# Altium project learn_Project.PrjPcb
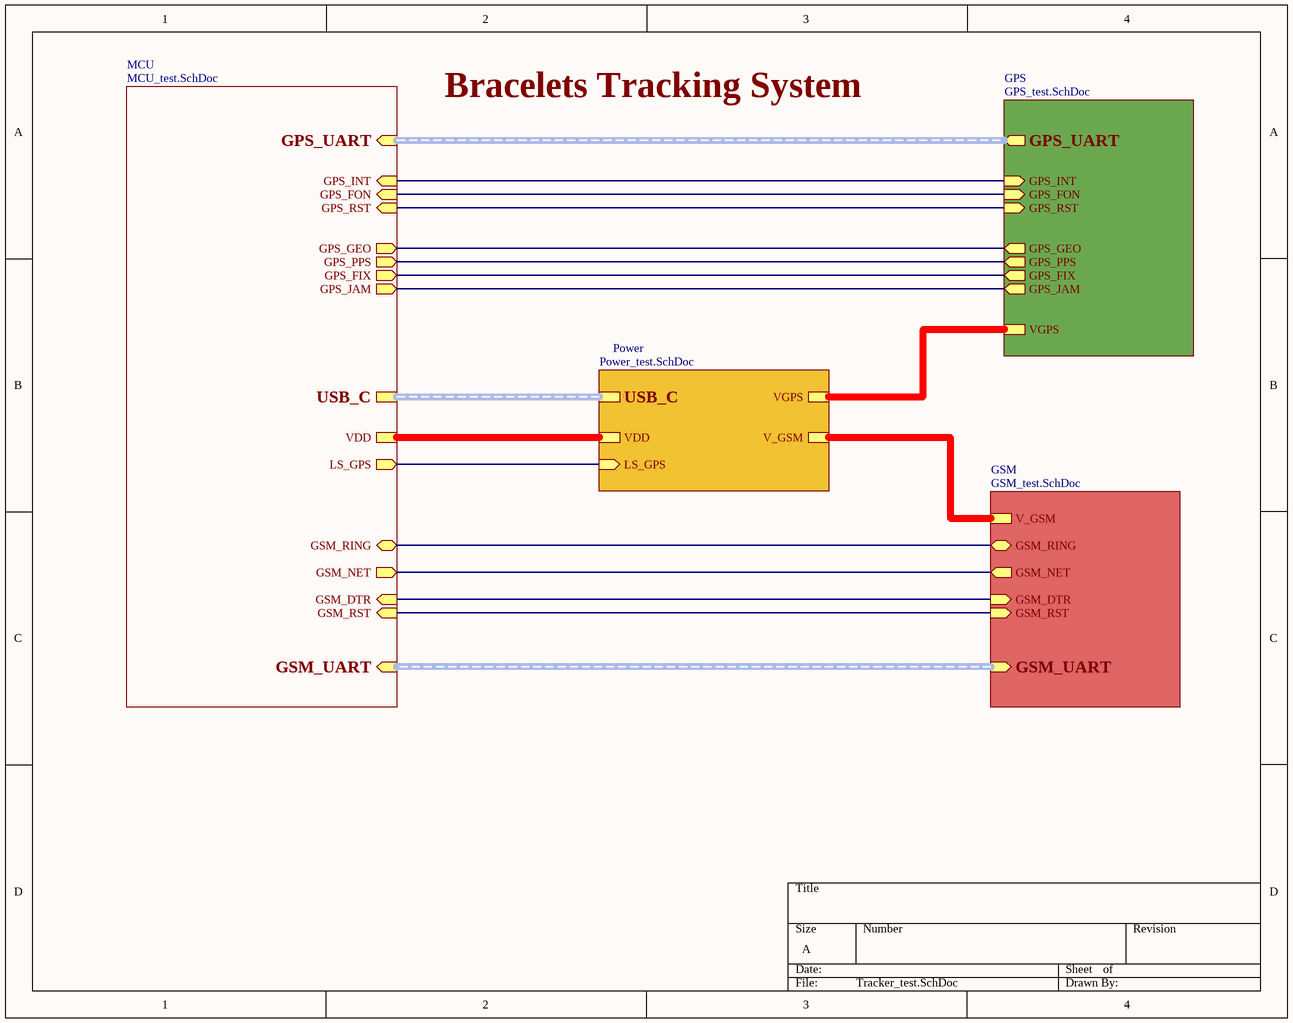
[diagram p0: Tracker_test.SchDoc]
5 sheets, 87 parts. Net scope: hierarchical (ports join the sheet entries above them; power ports are global).
Board file: Tracker.PcbDoc
Sheets:
  Tracker_test.SchDoc
    GPS = GPS_test.SchDoc
    Power = Power_test.SchDoc
    MCU = MCU_test.SchDoc
    GSM = GSM_test.SchDoc

## Sheet Tracker_test.SchDoc
size A; SheetNumber: 1; SheetTotal: 5

### Sub-sheets
GPS = GPS_test.SchDoc: VGPS, GPS_INT (in), GPS_RST (in), GPS_FON (in), GPS_PPS (out), GPS_JAM (out), GPS_FIX (out), GPS_GEO (out), GPS_UART (out, harness GPS_UART)
GSM = GSM_test.SchDoc: GSM_RING (bidir), GSM_DTR (in), GSM_NET (out), GSM_RST (in), GSM_UART (in, harness GSM_UART), V_GSM
MCU = MCU_test.SchDoc: GPS_UART (in, harness GPS_UART), GPS_INT (in), GPS_RST (in), GPS_FON (in), GPS_PPS (out), GPS_JAM (out), GPS_FIX (out), GPS_GEO (out), VDD, LS_GPS (out), GSM_RING (bidir), GSM_DTR (in), GSM_NET (out), GSM_RST (in), GSM_UART (in, harness GSM_UART), USB_C
Power = Power_test.SchDoc: VDD, VGPS, V_GSM, LS_GPS (in), USB_C

### Nets
DTR: sheet MCU/GSM_DTR, sheet GSM/GSM_DTR
GPS_FIX: sheet GPS/GPS_FIX, sheet MCU/GPS_FIX
GPS_FON: sheet GPS/GPS_FON, sheet MCU/GPS_FON
GPS_GEO: sheet GPS/GPS_GEO, sheet MCU/GPS_GEO
GPS_INT: sheet GPS/GPS_INT, sheet MCU/GPS_INT
GPS_JAM: sheet GPS/GPS_JAM, sheet MCU/GPS_JAM
GPS_PPS: sheet GPS/GPS_PPS, sheet MCU/GPS_PPS
GPS_RST: sheet GPS/GPS_RST, sheet MCU/GPS_RST
GSM_NET: sheet MCU/GSM_NET, sheet GSM/GSM_NET
GSM_RING: sheet MCU/GSM_RING, sheet GSM/GSM_RING
GSM_RST: sheet MCU/GSM_RST, sheet GSM/GSM_RST
LS_GPS: sheet Power/LS_GPS, sheet MCU/LS_GPS
(unnamed): sheet GPS/VGPS, sheet Power/VGPS
(unnamed): sheet Power/VDD, sheet MCU/VDD
(unnamed): sheet Power/V_GSM, sheet GSM/V_GSM

### Buses and harness runs
harness sheet GPS/GPS_UART = sheet MCU/GPS_UART
harness sheet GSM/GSM_UART = sheet MCU/GSM_UART
harness sheet MCU/USB_C = sheet Power/USB_C

### Notes on the sheet
- Bracelets Tracking System

## Sheet GPS_test.SchDoc
size A; SheetNumber: 3; SheetTotal: 5
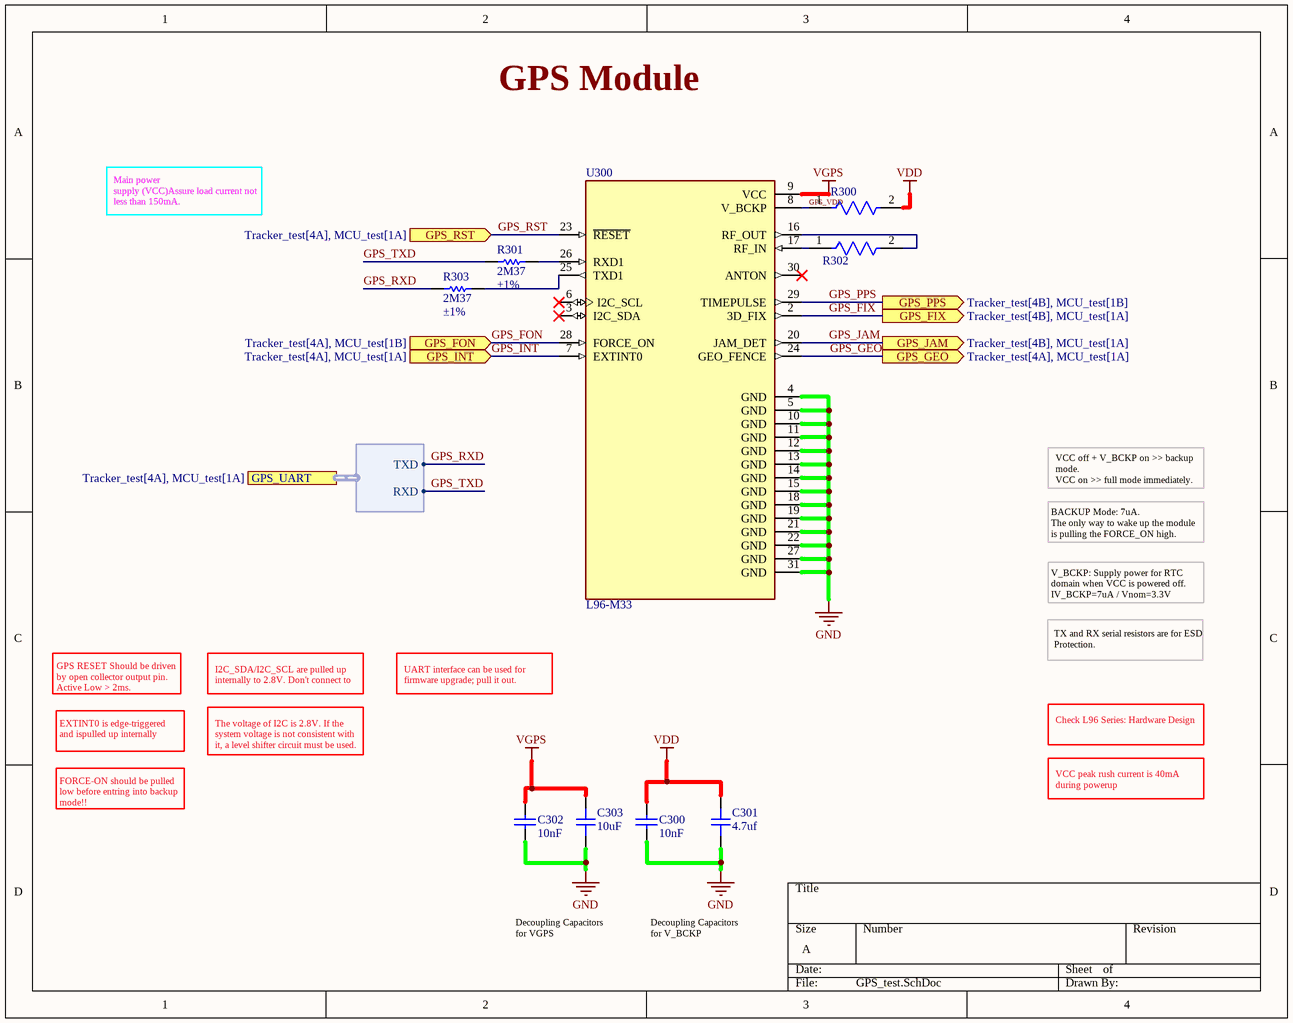
[diagram p1: GPS_test.SchDoc]

### Parts
C300  value 10nF  [C0402 - duplicate]  (hidden comment: CAP)
C301  4.7uf  [CAP_0402]
C302  value 10nF  [C0402 - duplicate]  (hidden comment: CAP)
C303  10uF  [CAP_0402]
R300  AF0402JR-070RL  [FP-AF0402-IPC_A]  (value not drawn)
R301  value 2M37  Tolerance: ±1%  [R0402]  (hidden comment: 100)
R302  AF0402JR-070RL  [FP-AF0402-IPC_A]  (value not drawn)
R303  value 2M37  Tolerance: ±1%  [R0402]  (hidden comment: 100)
U300  L96-M33  [XCVR_L96-M33]

### Ports
GPS_FIX (out, see Tracker_test[4B], MCU_test[1A]), GPS_FON (in, see Tracker_test[4A], MCU_test[1B]), GPS_GEO (out, see Tracker_test[4A], MCU_test[1A]), GPS_INT (in, see Tracker_test[4A], MCU_test[1A]), GPS_JAM (out, see Tracker_test[4B], MCU_test[1A]), GPS_PPS (out, see Tracker_test[4B], MCU_test[1B]), GPS_RST (in, see Tracker_test[4A], MCU_test[1A]), GPS_UART (harness GPS_UART, see Tracker_test[4A], MCU_test[1A])

### Harnesses
GPS_UART: TXD, RXD

### Nets
GND: C300.2 C301.1 C302.2 C303.1 U300.4(GND) U300.5(GND) U300.10(GND) U300.11(GND) U300.12(GND) U300.13(GND) U300.14(GND) U300.15(GND) U300.18(GND) U300.19(GND) U300.21(GND) U300.22(GND) U300.27(GND) U300.31(GND)
VDD: C300.1 C301.2 R300.2
VGPS: C302.1 C303.2 U300.9(VCC)
GPS_FIX: U300.2(3D_FIX) ; port GPS_FIX
GPS_FON: U300.28(FORCE_ON) ; port GPS_FON
GPS_GEO: U300.24(GEO_FENCE) ; port GPS_GEO
GPS_INT: U300.7(EXTINT0) ; port GPS_INT
GPS_JAM: U300.20(JAM_DET) ; port GPS_JAM
GPS_PPS: U300.29(TIMEPULSE) ; port GPS_PPS
GPS_RST: U300.23(~{RESET}) ; port GPS_RST
GPS_RXD: R303.1 ; port GPS_UART.TXD
GPS_TXD: R301.1 ; port GPS_UART.RXD
GPS_VDD: R300.1 U300.8(V_BCKP)
NetR301_2: R301.2 U300.26(RXD1)
NetR302_1: R302.1 U300.17(RF_IN)
NetR302_2: R302.2 U300.16(RF_OUT)
NetR303_2: R303.2 U300.25(TXD1)

Not connected (* = marked no-connect by the designer): U300 3(I2C_SDA)* 6(I2C_SCL)* 30(ANTON)*

### Notes on the sheet
- GPS Module
- Main power
  supply (VCC)Assure load current not
  less than 150mA.
- VCC off + V_BCKP on >> backup mode.
  VCC on >> full mode immediately.
- BACKUP Mode: 7uA.
  The only way to wake up the module is pulling the FORCE_ON high.
- V_BCKP: Supply power for RTC
  domain when VCC is powered off.
  IV_BCKP=7uA / Vnom=3.3V
- GPS RESET Should be driven by open collector output pin.
  Active Low > 2ms.
- I2C_SDA/I2C_SCL are pulled up internally to 2.8V. Don't connect to
- UART interface can be used for firmware upgrade; pull it out.
- TX and RX serial resistors are for ESD Protection.
- EXTINT0 is edge-triggered and ispulled up internally
- The voltage of I2C is 2.8V. If the system voltage is not consistent with it, a level shifter circuit must be used.
- Check L96 Series: Hardware Design
- FORCE-ON should be pulled low before entring into backup mode!!
- VCC peak rush current is 40mA during powerup
- Decoupling Capacitors for VGPS
- Decoupling Capacitors for V_BCKP

### Library data of the parts
C300 C302 = CAP: CAP CER 0.1UF 10V X7R 0603; Part Number: C00062; Manufacturer: KEMET - Electronic Component; Manufacturer Part Number: C0603C104K8RACTU; Tolerance: ±10%; Supplier 1: Digi-Key; Supplier Part Number 1: 399-1095-2-ND; HelpURL: http://www.kemet.com/Lists/ProductCatalog/Attachments/53/KEM_C1002_X7R_SMD.pdf; Operating Temperature: -55°C ~ 125°C; Type: CER; Temperature Coefficient: X7R; Voltage: 10V
C301 C303 = CAP_0402: Capacitor SMD 0402; Manufacturer: *; Manufacturer Part Number: *; Distributor Link: *; LCSC: *; Rating: *; Dielectric: *
R300 R302 = CMP-03412-048355-1: Anti-Sulfurated Chip Resistors Automotive Grade 0Ω 0402; Tolerance: 5%; Resistance: 0R; Max Power Dissipation: 63mW; Case Code (Metric): 1005; Packaging: Tape and Reel; Features: Moisture Resistant; Termination: SMD/SMT; Package Quantity: 10000; RoHS Compliant: Yes; Case/Package: 0402; Number of Terminations: 2; Series: AF; Length: 0.039inch; Max Operating Temperature: 155°C; Min Operating Temperature: -55°C; Resistor Type: Thick Film; Height: 0.015inch; Weight: 2.3E-05oz; Width: 0.5mm; Case Code (Imperial): 0402
R301 R303 = RES: RES SMD 15 OHM 1% 1/10W 0603; Part Number: R00007; Manufacturer: Yageo; Manufacturer Part Number: RC0603FR-0715RL; Temperature Coefficient: ±100ppm/°C; Supplier 1: Digi-Key; Supplier Part Number 1: 311-15.0HRCT-ND; HelpURL: http://www.yageo.com/NewPortal/yageodocoutput?fileName=/pdf/R-Chip/PYu-RC_Group_51_RoHS_L_3.pdf; Power: 1/10W; Operating Temperature: -55°C ~ 155°C
U300 = L96-M33: L96 is a concurrent multi-GNSS receiver module with embedded chip antenna. With 33 tracking channels, 99 acquisition channels and 210 PRN channels, L96 supports concurrent reception of up to three GNSS systems (GPS+GLONASS+Galileo); MF: Quectel; SnapEDA_Link: https://www.snapeda.com/parts/L96-M33/Quectel/view-part/2780781/?ref=snap; Price: None; MP: L96-M33; Availability: Unavailable; Value: *; Package: None

## Sheet Power_test.SchDoc
size A3; SheetNumber: 2; SheetTotal: 5
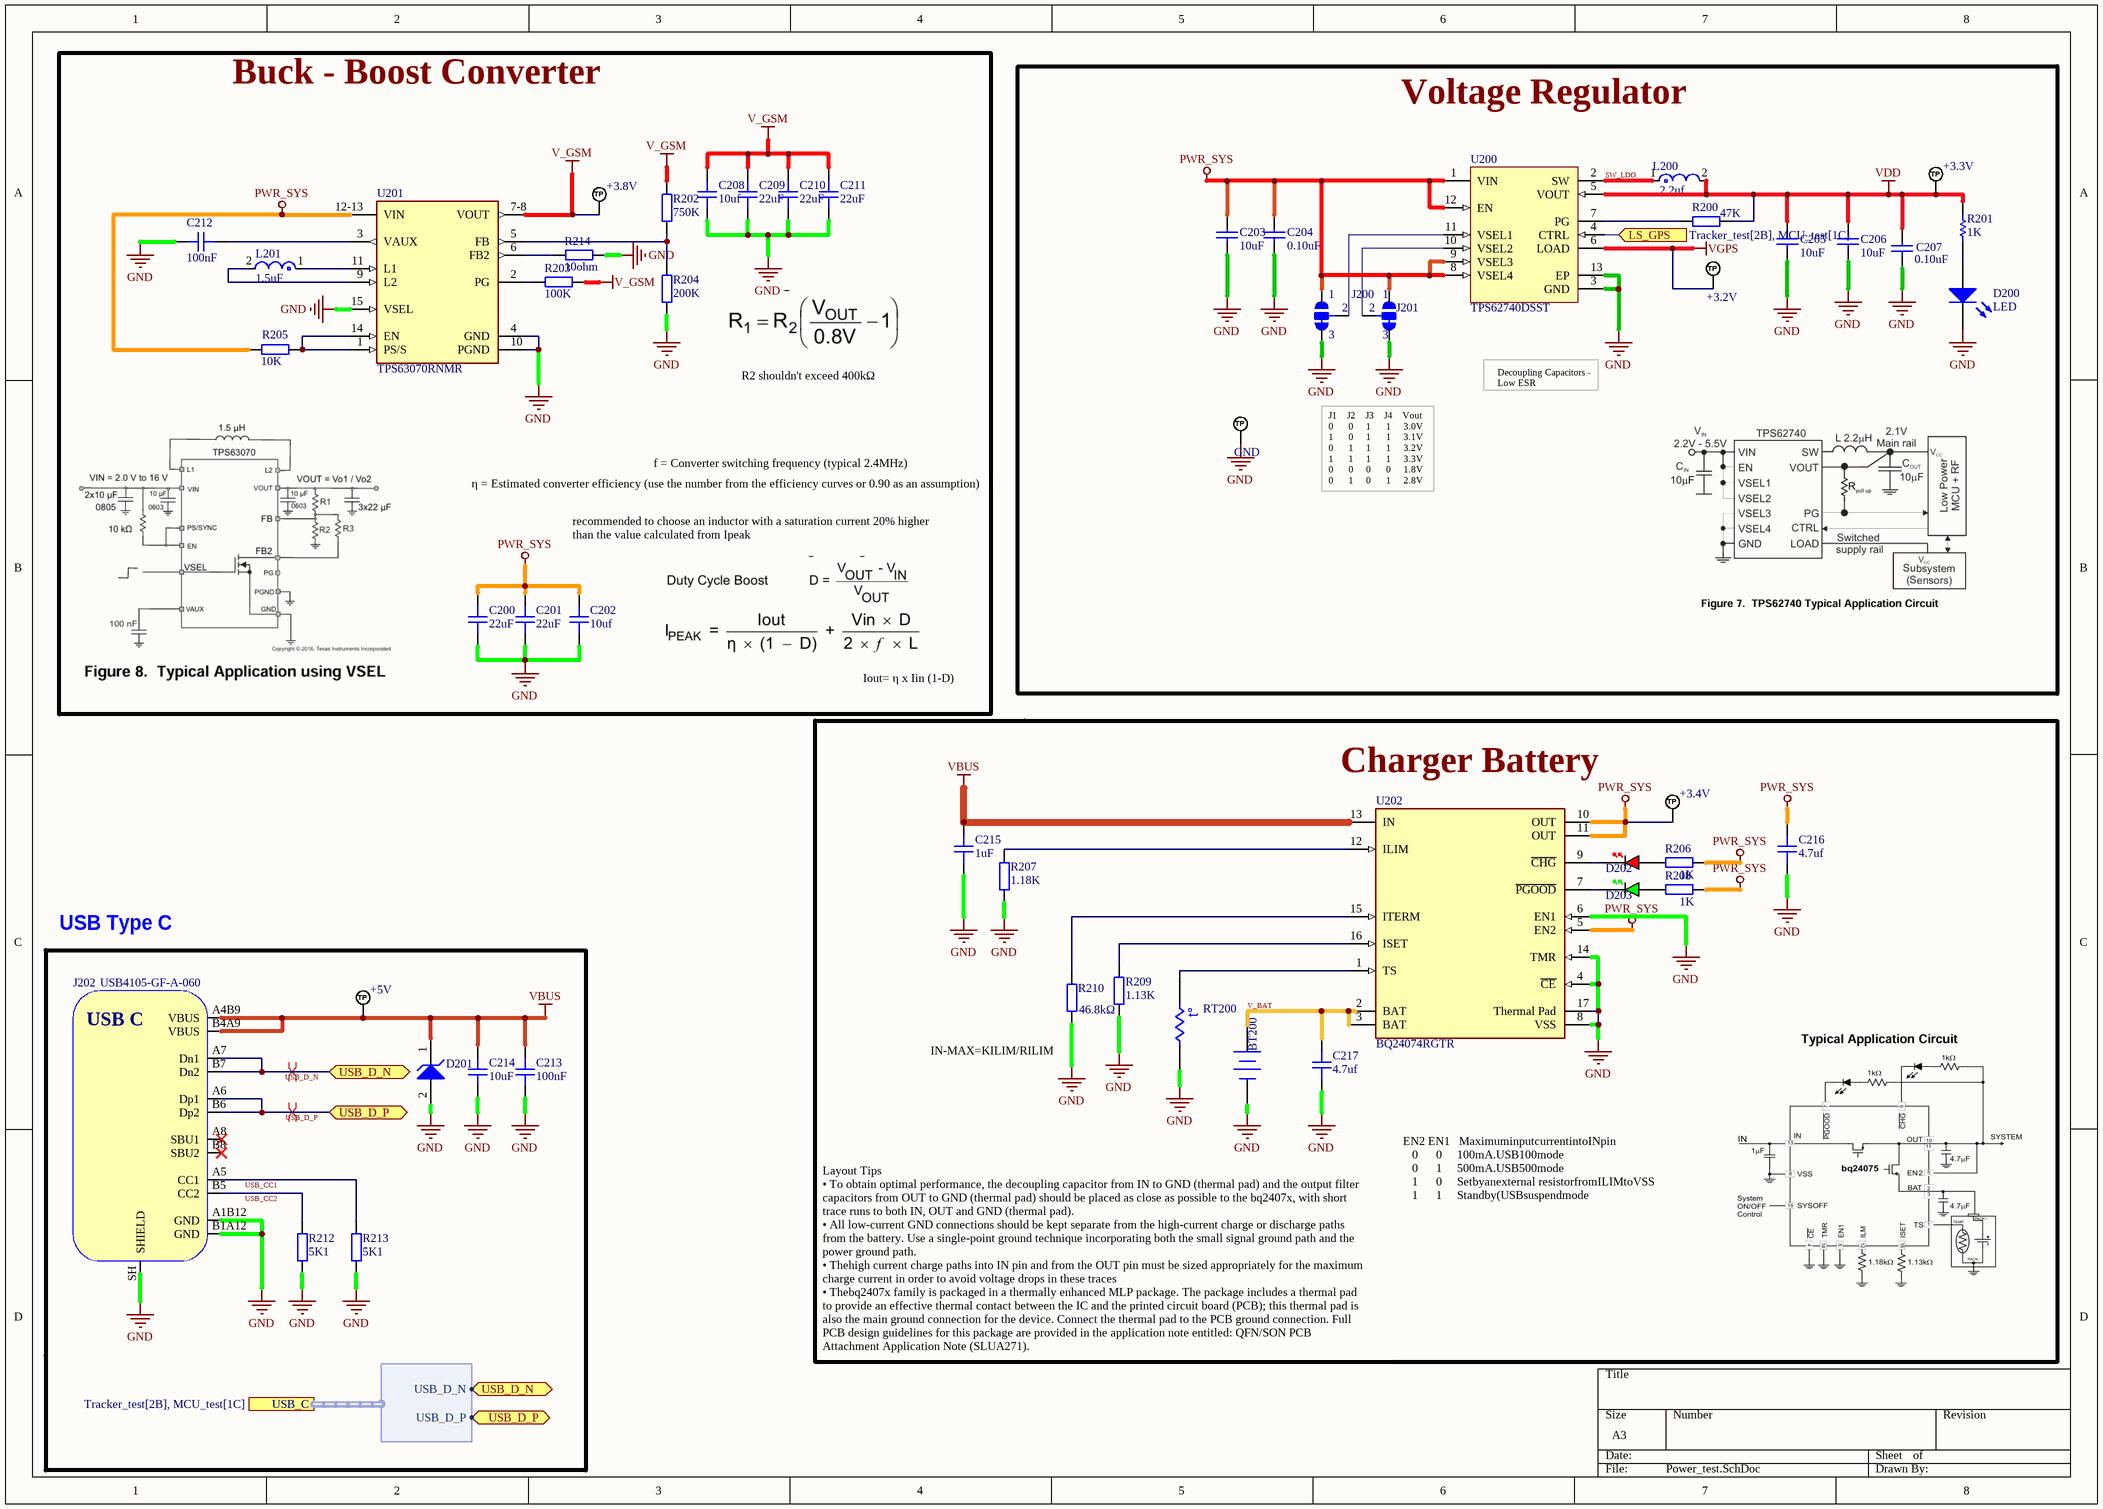
[diagram p2: Power_test.SchDoc]

### Parts
+3.2V  TP_NOBOM  [PAD_RND_1MM]  (value not drawn)  (no BOM)
+3.3V  TP_NOBOM  [PAD_RND_1MM]  (value not drawn)  (no BOM)
+3.4V  TP_NOBOM  [PAD_RND_1MM]  (value not drawn)  (no BOM)
+3.8V  TP_NOBOM  [PAD_RND_1MM]  (value not drawn)  (no BOM)
+5V  TP_NOBOM  [PAD_RND_1MM]  (value not drawn)  (no BOM)
BT200  Battery  [BAT-2]  (value not drawn)
C200  22uF  [CAP_0805]
C201  22uF  [CAP_0805]
C202  10uf  [CAP_0603]
C203  value 10uF  [C0402 - duplicate]  (hidden comment: CAP)
C204  value 0.10uF  [C0402]  (hidden comment: 0.1uf)
C205  value 10uF  [C0402 - duplicate]  (hidden comment: CAP)
C206  value 10uF  [C0402 - duplicate]  (hidden comment: CAP)
C207  value 0.10uF  [C0402]  (hidden comment: 0.1uf)
C208  10uf  [CAP_0603]
C209  22uF  [CAP_0805]
C210  22uF  [CAP_0805]
C211  22uF  [CAP_0805]
C212  100nF  [CAP_0603]
C213  100nF  [CAP_0402]
C214  10uF  [CAP_0402]
C215  1uF  [CAP_0402]
C216  4.7uf  [CAP_0402]
C217  4.7uf  [CAP_0402]
D200  LED  [LED-0603-R]
D201  SZSMF6.0AT1G  [ONSC-SOD-123FL-2-498_V]  (value not drawn)
D202  RED  [LED_0402_RED]  (value not drawn)
D203  GREEN  [LED_0402_GREEN]  (value not drawn)
GND  TP_NOBOM  [PAD_RND_1MM]  (value not drawn)  (no BOM)
J200  JUMPER-3-PAD  [JUMPER-3-NC]  (value not drawn)
J201  JUMPER-3-PAD  [JUMPER-3-NC]  (value not drawn)
J202  USB4105-GF-A-060  [USB4105-GF-A-060]
L200  2.2uf  [FP-LPS3314-MFG]
L201  1.5uF  [FP-XFL4020-MFG]
R200  47K  [RES_0402]
R201  1K  [R0402]
R202  750K  [RES_0402]
R203  100K  [RES_0402]
R204  200K  [RES_0402]
R205  10K  [RES_0402]
R206  1K  [RES_0402]
R207  1.18K  [RES_0402]
R208  1K  [RES_0402]
R209  1.13K  [RES_0402]
R210  46.8kΩ  [RES_0402]
R212  5K1  [RES_0603]
R213  5K1  [RES_0603]
R214  10ohm  [RES_0402]
RT200  Res Thermal  [6-0805_N]  (value not drawn)
U200  TPS62740DSST  [DSS0012A_V]
U201  TPS63070RNMR  [FP-RNM0015A-MFG]
U202  BQ24074RGTR  [FP-RGT0016C-MFG]

### Blocks framed on the sheet
Buck - Boost Converter: +3.8V C200-C202 C208-C212 L201 R202-R205 R214 U201
Voltage Regulator: +3.2V +3.3V C203-C207 D200 GND J200 J201 L200 R200 R201 U200
Charger Battery: +3.4V BT200 C215-C217 D202 D203 R206-R210 RT200 U202
USB Type C: +5V C213 C214 D201 J202 R212 R213

### Ports
LS_GPS (in, see Tracker_test[2B], MCU_test[1C]), USB_C (harness USB_C, see Tracker_test[2B], MCU_test[1C]), USB_D_N (bidir), USB_D_P (bidir)

### Harnesses
USB_C: USB_D_N, USB_D_P

### Nets
GND: BT200.2(-) C200.1 C201.1 C202.1 C203.2 C204.2 C205.2 C206.2 C207.2 C208.1 C209.1 C210.1 C211.1 C212.1 C213.1 C214.1 C215.1 C216.2 C217.2 D200.2(K) D201.2(A) GND.1(TP) J200.3 J201.3 J202.A1B12(GND) J202.B1A12(GND) J202.SH(SHIELD) R204.1 R207.1 R209.1 R210.2 R212.1 R213.1 R214.1 RT200.2 U200.3(GND) U200.13(EP) U201.4(GND) U201.10(PGND) U201.15(VSEL) U202.4(~{CE}) U202.6(EN1) U202.8(VSS) U202.14(TMR) U202.17(Thermal_Pad)
PWR_SYS: +3.4V.1(TP) C200.2 C201.2 C202.2 C203.1 C204.1 C216.1 J200.1 J201.1 R205.1 R206.2 R208.2 U200.1(VIN) U200.8(VSEL4) U200.9(VSEL3) U200.12(EN) U201.12-13(VIN) U202.5(EN2) U202.10(OUT) U202.11(OUT)
V_GSM: +3.8V.1(TP) C208.2 C209.2 C210.2 C211.2 R202.2 R203.1 U201.7-8(VOUT)
VBUS: +5V.1(TP) C213.2 C214.2 C215.2 D201.1(K) J202.A4B9(VBUS) J202.B4A9(VBUS) U202.13(IN)
VDD: +3.3V.1(TP) C205.1 C206.1 C207.1 L200.2 R200.2 R201.1 U200.5(VOUT)
VGPS: +3.2V.1(TP) U200.6(LOAD)
LS_GPS: U200.4(CTRL) ; port LS_GPS
SW_LDO: L200.1 U200.2(SW)
USB_CC1: J202.A5(CC1) R213.2
USB_CC2: J202.B5(CC2) R212.2
USB_D_N: J202.A7(Dn1) J202.B7(Dn2) ; port USB_D_N, port USB_C.USB_D_N
USB_D_P: J202.A6(Dp1) J202.B6(Dp2) ; port USB_D_P, port USB_C.USB_D_P
V_BAT: BT200.1(+) C217.1 U202.2(BAT) U202.3(BAT)
NetC212_2: C212.2 U201.3(VAUX)
NetD200_1: D200.1(A) R201.2
NetD202_A: D202.A R206.1
NetD202_K: D202.K U202.9(~{CHG})
NetD203_A: D203.A R208.1
NetD203_K: D203.K U202.7(~{PGOOD})
NetJ200_2: J200.2 U200.11(VSEL1)
NetJ201_2: J201.2 U200.10(VSEL2)
NetL201_1: L201.1 U201.11(L1)
NetL201_2: L201.2 U201.9(L2)
NetR200_1: R200.1 U200.7(PG)
NetR202_1: R202.1 R204.2 U201.5(FB)
NetR203_2: R203.2 U201.2(PG)
NetR205_2: R205.2 U201.1(PS/S) U201.14(EN)
NetR207_2: R207.2 U202.12(ILIM)
NetR209_2: R209.2 U202.16(ISET)
NetR210_1: R210.1 U202.15(ITERM)
NetR214_2: R214.2 U201.6(FB2)
NetRT200_1: RT200.1 U202.1(TS)

Not connected (* = marked no-connect by the designer): J202 A8(SBU1)* B8(SBU2)*

### Layout directives
differential pair; differential pair class USB: USB_D_N, USB_D_P

### Notes on the sheet
- R2 shouldn't exceed 400kΩ
- Decoupling Capacitors - Low ESR
- η = Estimated converter efficiency (use the number from the efficiency curves or 0.90 as an assumption)
- f = Converter switching frequency (typical 2.4MHz)
- J1    J2    J3    J4    Vout
  0      0     1      1     3.0V
  1      0     1      1     3.1V
  0      1     1      1     3.2V
  1      1     1      1     3.3V
  0      0     0      0     1.8V
  0      1     0      1     2.8V
- recommended to choose an inductor with a saturation current 20% higher
  than the value calculated from Ipeak
- Iout= η x Iin (1-D)
- (near R210) IN-MAX=KILIM/RILIM
- EN2 EN1   MaximuminputcurrentintoINpin
  0      0     100mA.USB100mode
  0      1     500mA.USB500mode
  1      0     Setbyanexternal resistorfromILIMtoVSS
  1      1     Standby(USBsuspendmode
- Layout Tips
  • To obtain optimal performance, the decoupling capacitor from IN to GND (thermal pad) and the output filter
  capacitors from OUT to GND (thermal pad) should be placed as close as possible to the bq2407x, with short
  trace runs to both IN, OUT and GND (thermal pad).
  • All low-current GND connections should be kept separate from the high-current charge or discharge paths
  from the battery. Use a single-point ground technique incorporating both the small signal ground path and the
  power ground path.
  • Thehigh current charge paths into IN pin and from the OUT pin must be sized appropriately for the maximum
  charge current in order to avoid voltage drops in these traces
  • Thebq2407x family is packaged in a thermally enhanced MLP package. The package includes a thermal pad
  to provide an effective thermal contact between the IC and the printed circuit board (PCB); this thermal pad is
  also the main ground connection for the device. Connect the thermal pad to the PCB ground connection. Full
  PCB design guidelines for this package are provided in the application note entitled: QFN/SON PCB
  Attachment Application Note (SLUA271).
- (in symbol Res Thermal) t°
- (in symbol USB4105-GF-A-060) USB C

### Library data of the parts
+3.2V +3.3V +3.4V +3.8V +5V GND = TEST_POINT_RND_1MM: Test Point Round 1mm (NO BOM)
BT200 = Battery: Multicell Battery; Published: 24-Mar-1999; LatestRevisionDate: 17-Jul-2002; LatestRevisionNote: Re-released for DXP Platform.; PackageReference: BAT-2; Publisher: Altium Limited; PackageDescription: Battery; 2 Leads
C200 C201 C209-C211 = CAP_0805: Capacitor SMD 0805; Manufacturer: *; Manufacturer Part Number: *; Distributor Link: *; LCSC: *; Rating: *; Dielectric: *
C202 C208 C212 = CAP_0603: Capacitor SMD 0603; Manufacturer: *; Manufacturer Part Number: *; Distributor Link: *; LCSC: *; Rating: *; Dielectric: *
C203 C205 C206 = CAP: CAP CER 10UF 10V X5R 0402; Part Number: C00062; Manufacturer: KEMET - Electronic Component; Manufacturer Part Number: C0603C104K8RACTU; Tolerance: ±10%; Temperature Coefficient: X7R; Supplier 1: Digi-Key; Supplier Part Number 1: 399-1095-2-ND; HelpURL: http://www.kemet.com/Lists/ProductCatalog/Attachments/53/KEM_C1002_X7R_SMD.pdf; Operating Temperature: -55°C ~ 125°C; Type: CER; Voltage: 10V
C204 C207 = CAP_2: CAP CER 0.1UF 10V X5R 0402; Part Number: C00062; Manufacturer: KEMET - Electronic Component; Manufacturer Part Number: C0603C104K8RACTU; Tolerance: ±10%; Temperature Coefficient: X7R; Supplier 1: Digi-Key; Supplier Part Number 1: 399-1095-2-ND; HelpURL: http://www.kemet.com/Lists/ProductCatalog/Attachments/53/KEM_C1002_X7R_SMD.pdf; Operating Temperature: -55°C ~ 125°C; Type: CER; Voltage: 10V
C213-C217 = CAP_0402: Capacitor SMD 0402; Manufacturer: *; Manufacturer Part Number: *; Distributor Link: *; LCSC: *; Rating: *; Dielectric: *
D200 = LED: Typical RED GaAs LED; pin to pad: 1>A 2>K; Manufacturer: Lite-On Inc.; PartNumber: LTST-C190GKT; Published: 8-Jun-2000; LatestRevisionDate: 2016-10-04; LatestRevisionNote: Mech Layer 1 removed.; PackageReference: LED-1; Publisher: Walid Balid; PackageDescription: LED; 2 Leads; ComponentLink1Description: Datasheet link; ComponentLink1URL: http://media.digikey.com/pdf/Data%20Sheets/Lite-On%20PDFs/LTST-C190GKT.pdf; RoHS: Y; Supplier 1: Digi-Key; Supplier Part Number 1: 160-1183-1-ND
D201 = CMP-1061-00610-1: 200 W Transient Voltage Suppressor, 2-Pin SOD-123FL, Pb-Free, Tape and Reel; Manufacturer: On Semiconductor; Direction: Unidirectional; V(BR) Typ (V): 7.02; IR Max (uA): 400; PackageReference: SOD-123FL-2-498; ComponentLink1URL: http://www.onsemi.com/; RoHS: Pb-Free; ComponentLink2Description: Datasheet; PackageDescription: 2-Pin SOD, Body 1.65 x 2.7 mm; PackageVersion: Rev. D, 05/2013; ComponentLink3URL: http://www.onsemi.com/pub_link/Collateral/498-01.PDF; PartNumber: SZSMF6.0AT1G; Mounting Technology: Surface Mount; ComponentLink3Description: Package Specification; ComponentLink1Description: Manufacturer URL; DatasheetVersion: Rev. 7; ComponentLink2URL: http://www.onsemi.com/pub_link/Collateral/SMF5.0AT1-D.PDF; Packing: Tape and Reel
D202 = LED_0402_RED: LED 0402 RED SMD
D203 = LED_0402_GREEN: LED 0402 GREEN SMD
J202 = USB4105-GF-A-060: USB Connector Type C SMT 12 Pin; Manufacturer: GCT; Manufacturer Part Number: USB4105-GF-A-060; Distributor Link: https://eu.mouser.com/ProductDetail/GCT/USB4105-GF-A-060?qs=QNEnbhJQKvY2mocwNJzgfA%3D%3D
L200 = CMP-11268-000121-1: Fixed Inductors 82uH Shld 20% 260mA 2 Ohms LPS3314-823MRC    Inductor, Multilayer, Ceramic, 2.2uH, 0.7A, 0.23 ohm, SMD
L201 = CMP-11268-000104-1: Inductor Power Shielded Wirewound 1.5uH 20% 100KHz 9.1A 15.8mOhm DCR 1515 Automotive Embossed Plastic T/R     XFL4020-152MEC; Core Material: Composite; DC Resistance (DCR): 15.8mR; Saturation Current: 4.1A; Self Resonant Frequency: 59MHz; Tolerance: 20%; Inductance: 1.5uH; Max DC Current: 9.1A; RoHS Compliant: Yes; Max Operating Temperature: 125°C; Length: 4.3mm; Case/Package: SMD/SMT; Mount: Surface Mount; Shielding: Shielded; Min Operating Temperature: -40°C; RMS Current (Irms): 9.1A; Test Frequency: 100kHz; Inductance Tolerance: 20%; REACH SVHC: No SVHC; Packaging: Tape and Reel; Termination: SMD/SMT; Lead Free: Contains Lead; Width: 4.3mm; Series: XFL4020; Height: 2.1mm
R200 R202-R210 R214 = RES_0402: Resistor SMD 0402; Manufacturer: *; Manufacturer Part Number: *; Distributor Link: *; LCSC: *
R201 = RES: RES SMD 1K OHM 5% 1/16W 0402; Part Number: R00007; Manufacturer: Yageo; Manufacturer Part Number: RC0603FR-0715RL; Power: 1/10W; Temperature Coefficient: ±100ppm/°C; Value: 2M37; Tolerance: ±1%; Supplier 1: Digi-Key; Supplier Part Number 1: 311-15.0HRCT-ND; HelpURL: http://www.yageo.com/NewPortal/yageodocoutput?fileName=/pdf/R-Chip/PYu-RC_Group_51_RoHS_L_3.pdf; Operating Temperature: -55°C ~ 155°C
R212 R213 = RES_0603: Resistor SMD 0603; Manufacturer: *; Manufacturer Part Number: *; Distributor Link: *; LCSC: *
RT200 = Res Thermal: Thermistor; Published: 24-Mar-1999; LatestRevisionDate: 29-May-2009; LatestRevisionNote: IPC-7351 Footprint Added.; PackageVersion: Mar-2003; PackageReference: 6-0805; Publisher: Altium Limited; PackageDescription: Chip Resistor 0805 Case Size; Code_IPC: RESC2012
U200 = CMP-0323-00573-2: Step Down Converter For Low Power Applications, 2.2 to 5.5 V VIN, -40 to 85 degC, 12-Pin WSON (DSS), RoHS, Tape and Reel; VIN Min: 2.2 V; VOUT Max: 3.3 V; VOUT Min: 1.8 V; VIN Max: 5.5 V; PackageVersion: 4209244/C, 07/2011; ComponentLink1URL: http://www.ti.com/; Packing: Tape and Reel; PartNumber: TPS62740; ComponentLink2URL: http://www.ti.com/lit/ds/symlink/tps62740.pdf; RoHS: TRUE; ComponentLink3Description: Package Specification; Temperature Min: -40 degC; ComponentLink1Description: Manufacturer URL; PackageReference: DSS0012A; ComponentLink2Description: Datasheet; DatasheetVersion: SLVSB02B; Temperature Max: 85 degC; ComponentLink3URL: http://www.ti.com/litv/pdf/mpds336b; PackageDescription: 12-Pin Plastic Small Outline, Body 3 x 2 mm, Pitch 0.5 mm; Mounting Technology: Surface Mount
U201 = CMP-04918-000409-1: IC REG BCK BST ADJ 3.6A 15VQFN; Synchronous Rectifier: Yes; Output Type: Adjustable; Output Current: 2A; Max Input Voltage: 16V; Switching Frequency: 2.4MHz; Min Output Voltage: 2.5V; Output Configuration: Positive; Min Input Voltage: 2V; Topology: Buck-Boost; Number of Outputs: 1; Max Output Voltage: 9V; Quiescent Current: 50uA; Max Operating Temperature: 125°C; Case/Package: VQFN; Number of Pins: 15; RoHS Compliant: Yes; Mount: Surface Mount; Min Operating Temperature: -40°C; Lead Free: Lead Free; Packaging: Tape and Reel
U202 = CMP-0321-00220-3: IC LI-ION CHARGE MGMT 16-QFN; Fault Protection: Over Voltage; Max Charge Current: 1.5A; Interface: USB; Max Supply Voltage: 10.2V; Number of Cells: 1; Battery Pack Voltage: 4.2V; Min Supply Voltage: 4.35V; Battery Chemistry: LITHIUM-ION; Min Input Voltage: 4.3V; Lead Free: Lead Free; Max Operating Temperature: 125°C; RoHS Compliant: Yes; Contact Plating: Gold; Min Operating Temperature: -40°C; Weight: 0.000808oz; Package Quantity: 3000; Radiation Hardening: No; Case/Package: VQFN; Output Voltage: 4.2V; Packaging: Tape and Reel; Series: -; Output Current: 1.5A; Number of Pins: 16
J200 J201 = JUMPER-3-PAD: Value: JUMPER-3-PAD

## Sheet MCU_test.SchDoc
size A4; SheetNumber: 5; SheetTotal: 5; SPICEModelCacheIOPLCZQZ: <root> / <DocumentId>IOPLCZQZ</DocumentId> / </root>
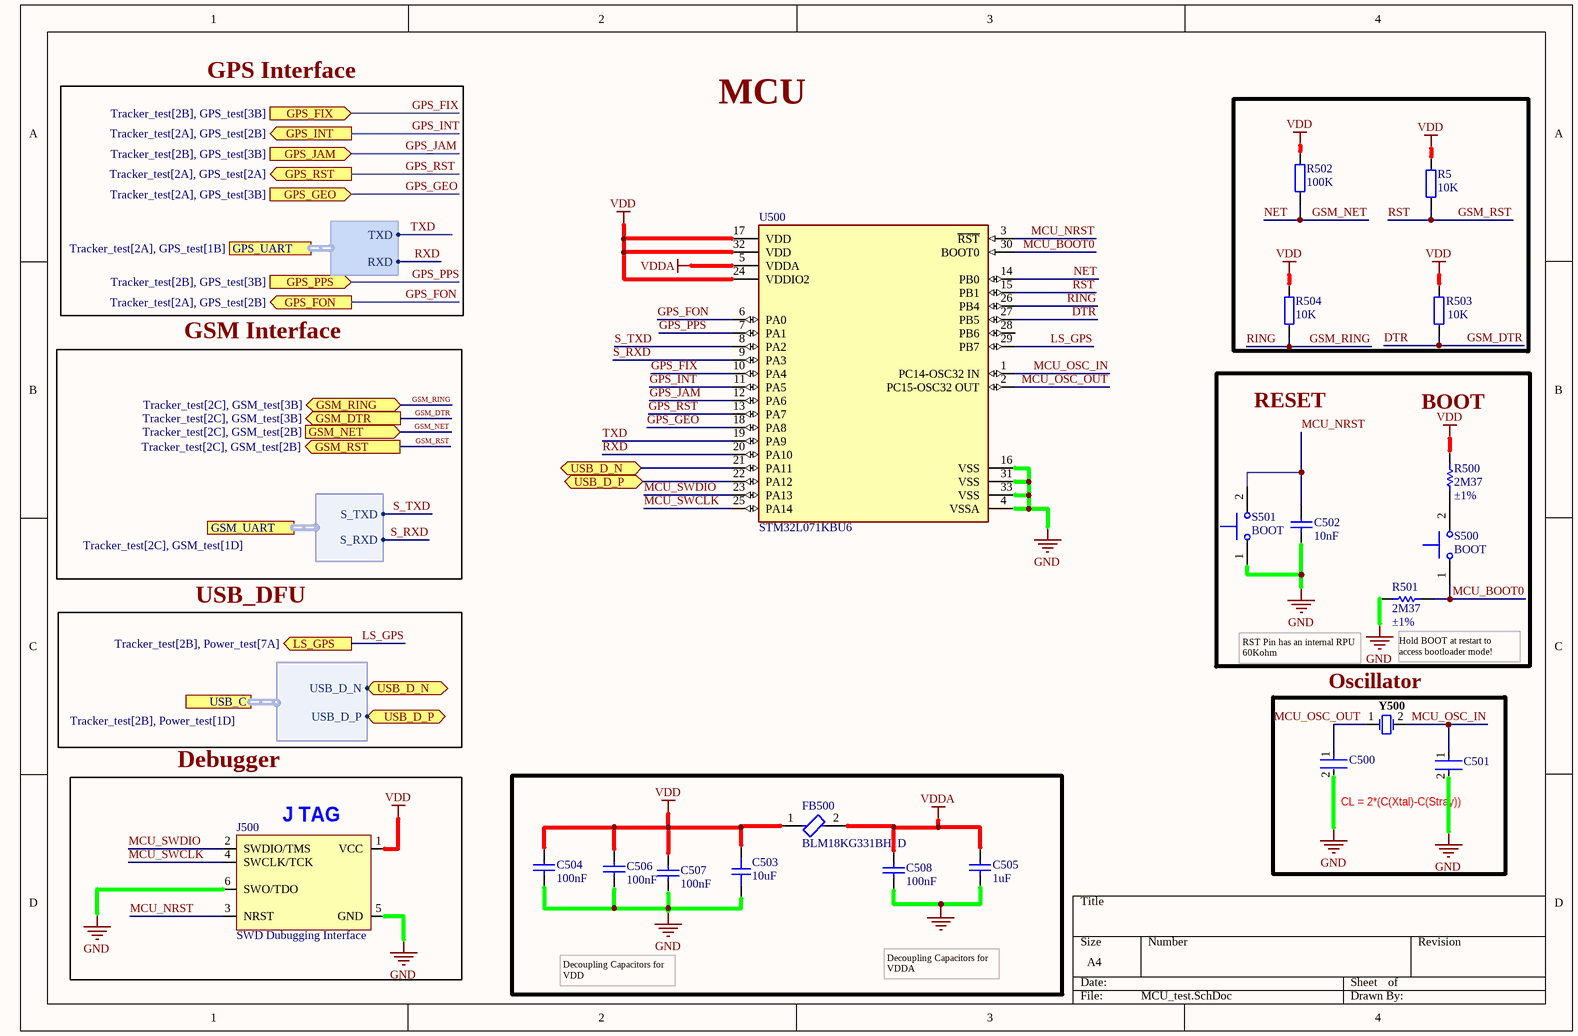
[diagram p3: MCU_test.SchDoc]

### Parts
C500  C0603C220K5RACAUTO  [FP-C0603C-CF-IPC_B]  (value not drawn)
C501  C0603C220K5RACAUTO  [FP-C0603C-CF-IPC_B]  (value not drawn)
C502  value 10nF  [C0402 - duplicate]  (hidden comment: CAP)
C503  10uF  [CAP_0402]
C504  value 100nF  [C0402 - duplicate]  (hidden comment: CAP)
C505  value 1uF  [C0402 - duplicate]  (hidden comment: CAP)
C506  value 100nF  [C0402 - duplicate]  (hidden comment: CAP)
C507  value 100nF  [C0402 - duplicate]  (hidden comment: CAP)
C508  value 100nF  [C0402 - duplicate]  (hidden comment: CAP)
FB500  BLM18KG331BH1D  [FP-BLM18-0_15-t0_8-IPC_A]
J500  SWD Dubugging Interface  [TC2030-NL-FP]  (no BOM)
R5  10K  [RES_0402]
R500  value 2M37  Tolerance: ±1%  [R0402]  (hidden comment: 1K)
R501  value 2M37  Tolerance: ±1%  [R0402]  (hidden comment: 10K)
R502  100K  [RES_0402]
R503  10K  [RES_0402]
R504  10K  [RES_0402]
S500  BOOT  [SW_B3U-1000P]
S501  BOOT  [SW_B3U-1000P]
U500  STM32L071KBU6  [FP-UFQFPN32-A0B8-IPC_B]
Y500  NX3225GD-8MHZ-STD-CRA-3  [NDK-NX3225GD-8MHZ-STD-CRA-3_V]  (value not drawn)

### Blocks framed on the sheet
Debugger: J500

### Ports
GPS_FIX (in, see Tracker_test[2B], GPS_test[3B]), GPS_FON (out, see Tracker_test[2A], GPS_test[2B]), GPS_GEO (in, see Tracker_test[2A], GPS_test[3B]), GPS_INT (out, see Tracker_test[2A], GPS_test[2B]), GPS_JAM (in, see Tracker_test[2B], GPS_test[3B]), GPS_PPS (in, see Tracker_test[2B], GPS_test[3B]), GPS_RST (out, see Tracker_test[2A], GPS_test[2A]), GPS_UART (harness GPS_UART, see Tracker_test[2A], GPS_test[1B]), GSM_DTR (out, see Tracker_test[2C], GSM_test[3B]), GSM_NET (in, see Tracker_test[2C], GSM_test[2B]), GSM_RING (bidir, see Tracker_test[2C], GSM_test[3B]), GSM_RST (out, see Tracker_test[2C], GSM_test[2B]), GSM_UART (harness GSM_UART, see Tracker_test[2C], GSM_test[1D]), LS_GPS (out, see Tracker_test[2B], Power_test[7A]), USB_C (harness USB_C, see Tracker_test[2B], Power_test[1D]), USB_D_N (bidir), USB_D_P (bidir)

### Harnesses
GPS_UART: TXD, RXD
GSM_UART: S_TXD, S_RXD
USB_C: USB_D_N, USB_D_P

### Nets
GND: C500.2 C501.2 C502.2 C503.1 C504.2 C505.2 C506.2 C507.2 C508.2 J500.5(GND) J500.6(SWO/TDO) R501.1 S501.1 U500.4(VSSA) U500.16(VSS) U500.31(VSS) U500.33(VSS)
VDD: C503.2 C504.1 C506.1 C507.1 FB500.1 J500.1(VCC) R5.1 R500.1 R502.1 R503.2 R504.1 U500.17(VDD) U500.24(VDDIO2) U500.32(VDD)
VDDA: C505.1 C508.1 FB500.2 U500.5(VDDA)
DTR: R503.1 U500.27(PB5) ; port GSM_DTR  [also labelled GSM_DTR]
GPS_FIX: U500.10(PA4) ; port GPS_FIX
GPS_FON: U500.6(PA0) ; port GPS_FON
GPS_GEO: U500.18(PA8) ; port GPS_GEO
GPS_INT: U500.11(PA5) ; port GPS_INT
GPS_JAM: U500.12(PA6) ; port GPS_JAM
GPS_PPS: U500.7(PA1) ; port GPS_PPS
GPS_RST: U500.13(PA7) ; port GPS_RST
GSM_NET: R502.2 U500.14(PB0) ; port GSM_NET  [also labelled NET]
GSM_RING: R504.2 U500.26(PB4) ; port GSM_RING  [also labelled RING]
GSM_RST: R5.2 U500.15(PB1) ; port GSM_RST  [also labelled RST]
LS_GPS: U500.29(PB7) ; port LS_GPS
MCU_BOOT0: R501.2 S500.1 U500.30(BOOT0)
MCU_NRST: C502.1 J500.3(NRST) S501.2 U500.3(~{RST})
MCU_OSC_IN: C501.1 U500.1(PC14-OSC32_IN) Y500.2
MCU_OSC_OUT: C500.1 U500.2(PC15-OSC32_OUT) Y500.1
MCU_SWCLK: J500.4(SWCLK/TCK) U500.25(PA14)
MCU_SWDIO: J500.2(SWDIO/TMS) U500.23(PA13)
RXD: U500.20(PA10) ; port GPS_UART.RXD  [project net GPS_TXD]
S_RXD: U500.9(PA3) ; port GSM_UART.S_RXD  [project net GSM_TXD]
S_TXD: U500.8(PA2) ; port GSM_UART.S_TXD  [project net GSM_RXD]
TXD: U500.19(PA9) ; port GPS_UART.TXD  [project net GPS_RXD]
USB_D_N: U500.21(PA11) ; port USB_D_N, port USB_C.USB_D_N
USB_D_P: U500.22(PA12) ; port USB_D_P, port USB_C.USB_D_P
NetR500_2: R500.2 S500.2

Not connected (* = marked no-connect by the designer): U500 28(PB6)

### Notes on the sheet
- GPS Interface
- MCU
- GSM Interface
- RESET
- BOOT
- USB_DFU
- RST Pin has an internal RPU 60Kohm
- (near R501) Hold BOOT at restart to
  access bootloader mode!
- (near Y500) Oscillator
- (near J500) J TAG
- CL = 2*(C(Xtal)-C(Stray))
- Decoupling Capacitors for VDD
- Decoupling Capacitors for VDDA

### Library data of the parts
C500 C501 = CMP-03020-018041-1: Cap Ceramic 22pF 50V X7R 10% SMD 0603 125°C Punched Paper T/R; Manufacturer: KEMET; Tolerance: 0.1; Temperature Coefficient: 30ppm/°C; Automotive Grade: Grade 1; Capacitance: 22 pF; Temperature Range High: +125°C; Height: 0.87mm; Automotive: Yes; Temperature Range Low: -55°C; Category: Cap; Digikey Description: Cap Ceramic 22pF 50V X7R 10% SMD 0603 125°C Punched Paper T/R; Temperature Characteristic: X7R; Device Class L3: Ceramic Capacitors; ComponentLink2URL: https://api.kemet.com/component-edge/download/datasheet/C0603C100J5GACAUTO.pdf; Manufacturer Part Number: C0603C220K5RACAUTO; Value: 22 pF; Device Class L1: Passive Components; Package: C0603C-CF; Material: Ceramic; RoHS: TRUE; Lead Free: Yes; ComponentLink2Description: Datasheet; Device Class L2: Capacitors; Mouser Description: Cap Ceramic 22pF 50V X7R 10% SMD 0603 125°C Punched Paper T/R; Temperature: -55°C to +125°C; Octopart: https://octopart.com/c0603c220k5racauto-kemet-70963357; Voltage Rating: 50 V
C502 C504-C508 = CAP: as C300 on sheet GPS_test; Supplier 1: Digi-Key; Supplier Part Number 1: 399-1095-2-ND; HelpURL: http://www.kemet.com/Lists/ProductCatalog/Attachments/53/KEM_C1002_X7R_SMD.pdf; Operating Temperature: -55°C ~ 125°C; Type: CER; Temperature Coefficient: X7R; Voltage: 10V
C503 = CAP_0402: Capacitor SMD 0402; Manufacturer: *; Manufacturer Part Number: *; Distributor Link: *; LCSC: *; Rating: *; Dielectric: *
FB500 = CMP-06046-002312-1: Chip Ferrite Bead, 0603, 330Ω @ 100MHz, 0.08Ω, 25%, 1.2A; DC Resistance (DCR): 80mR; Number of Lines: 1; Case/Package: 0603; Max Operating Temperature: 150°C; Max Current Rating: 1.2A; Case Code (Metric): 1608; Case Code (Imperial): 0603; RoHS Compliant: Yes; Ratings: AEC-Q200; Min Operating Temperature: -55°C
J500 = TC2030-NL: Tag-Connect No-Solder SWD Debug Connector (No Legs) DO NOT PLACE; Manufacturer: Tag-Connect; Manufacturer Part Number: TC2030-NL-FP
R5 R502-R504 = RES_0402: Resistor SMD 0402; Manufacturer: *; Manufacturer Part Number: *; Distributor Link: *; LCSC: *
R500 R501 = RES: as R301 on sheet GPS_test; Supplier 1: Digi-Key; Supplier Part Number 1: 311-15.0HRCT-ND; HelpURL: http://www.yageo.com/NewPortal/yageodocoutput?fileName=/pdf/R-Chip/PYu-RC_Group_51_RoHS_L_3.pdf; Power: 1/10W; Operating Temperature: -55°C ~ 155°C
S500 S501 = B3U-1000P: SWITCH TACTILE SPST-NO 0.05A 12V; Manufacturer: Omron Electronic Components; SymbolCreator: a0412235; VDC_V: 12; SwitchFunction: Off-Mom; PositionCount: 1; CurrentRating_mA: 50; SymbolVersion: 2012-10-29; PartNumber: B3U-1000P; MountType: SMT; ComponentLink1Description: Datasheet URL; ComponentLink1URL: http://www.components.omron.com/components/web/PDFLIB.nsf/0/2DD3893C7DD33E9E862572900079E9D6/$file/B3U_1110.pdf; RoHS: Y; Circuit: SPST-NO; Orientation: Top Actuated; CompType: Switch; PackageReference: 3x1.6x2.5mm; Publisher: Texas Instruments; LatestRevisionDate: 2015-03-16; Supplier 1: Digi-Key; Supplier Part Number 1: SW1020CT-ND; Supplier 2: Mouser; Supplier Part Number 2: 653-B3U-1000P; Supplier 3: Farnell; Supplier Part Number 3: 1333652
U500 = CMP-12105-000059-1: IC MCU 32BIT 128KB FLASH 32QFPN; Manufacturer: STMicroelectronics; Number Of Uart Channels: 4; Number Of Adc Channels: 10; Max Junction Temp: +105°C; Number Of Cores: 1; Min Supply Voltage: 1.8V; Interface: I2C,SPI,UART,USART,LIN,IrDA,SMBus,Other; Frequency: 32MHz; Data Bus Width: 32bits; Number Of Timers/Counters: 9; Core Architecture: Arm Cortex-M0+; Number Of I2C Channels: 2; Memory Size: 128KBytes; Ram Size: 20KBytes; Number Of I/Os: 23; Max Supply Voltage: 3.6V; Device Class L3: Microcontrollers; Lead Free: Yes; Memory Type: FLASH; Ambient Temperature Range High: +85°C; RoHS: TRUE; ComponentLink2Description: Datasheet; Device Class L1: Integrated Circuits (ICs); Automotive: No; Temperature Range Low: -40°C; Octopart: https://octopart.com/stm32l071kbu6-stmicroelectronics-67270308; Ipc Land Pattern Name: QFN50P500X500X55-32; Number Of A/D Converters: 1; Height: 0.6mm; Manufacturer Part Number: STM32L071KBU6; Temperature Range High: +85°C; Digikey Description: IC MCU 32BIT 128KB FLASH 32QFPN; Mouser Description: ARM Microcontrollers - MCU; Category: IC; Number Of Spi Channels: 4; ComponentLink2URL: https://www.st.com/resource/en/datasheet/stm32l071cb.pdf; Ambient Temperature Range Low: -40°C; Package: UFQFPN32-A0B8; Device Class L2: Embedded Processors and Controllers; Temperature: -40°C to +85°C
Y500 = CMP-2000-07595-1: Crystal Unit, 8 MHz, 8 pF, -40 to 150 degC, 2-Pin SMD, RoHS, Tape and Reel; Manufacturer: NDK; Load Capacitance: 8pF; ESR (Equivalent Series Resistance): 500Ohm; Frequency Tolerance: 50ppm; Frequency Stability: 150ppm; Frequency: 8MHz; Case/Package: SMD/SMT; Datasheet Version: 11/2016; Min Operating Temperature: -40degC; Packaging: TapeandReel; Width: 0.098inch; Package Quantity: 3000; Number of Pins: 2; Package Description: 2-Pin Surface Mount Device, Body 3.2 x 2.5 mm; RoHSCompliant: True; Package Reference: NX3225GD-8MHZ-STD-CRA-3; Datasheet URL: http://www.ndk.com/images/products/catalog/c_NX3225GD-STD-CRA-3_e.pdf; Mounting Technology: SurfaceMount; Length: 0.126inch; Mount: SurfaceMount; Manufacturer URL: http://www.ndk.com/en/; Max Operating Temperature: 150degC; Height: 0.039inch

## Sheet GSM_test.SchDoc
size A; SheetNumber: 4; SheetTotal: 5
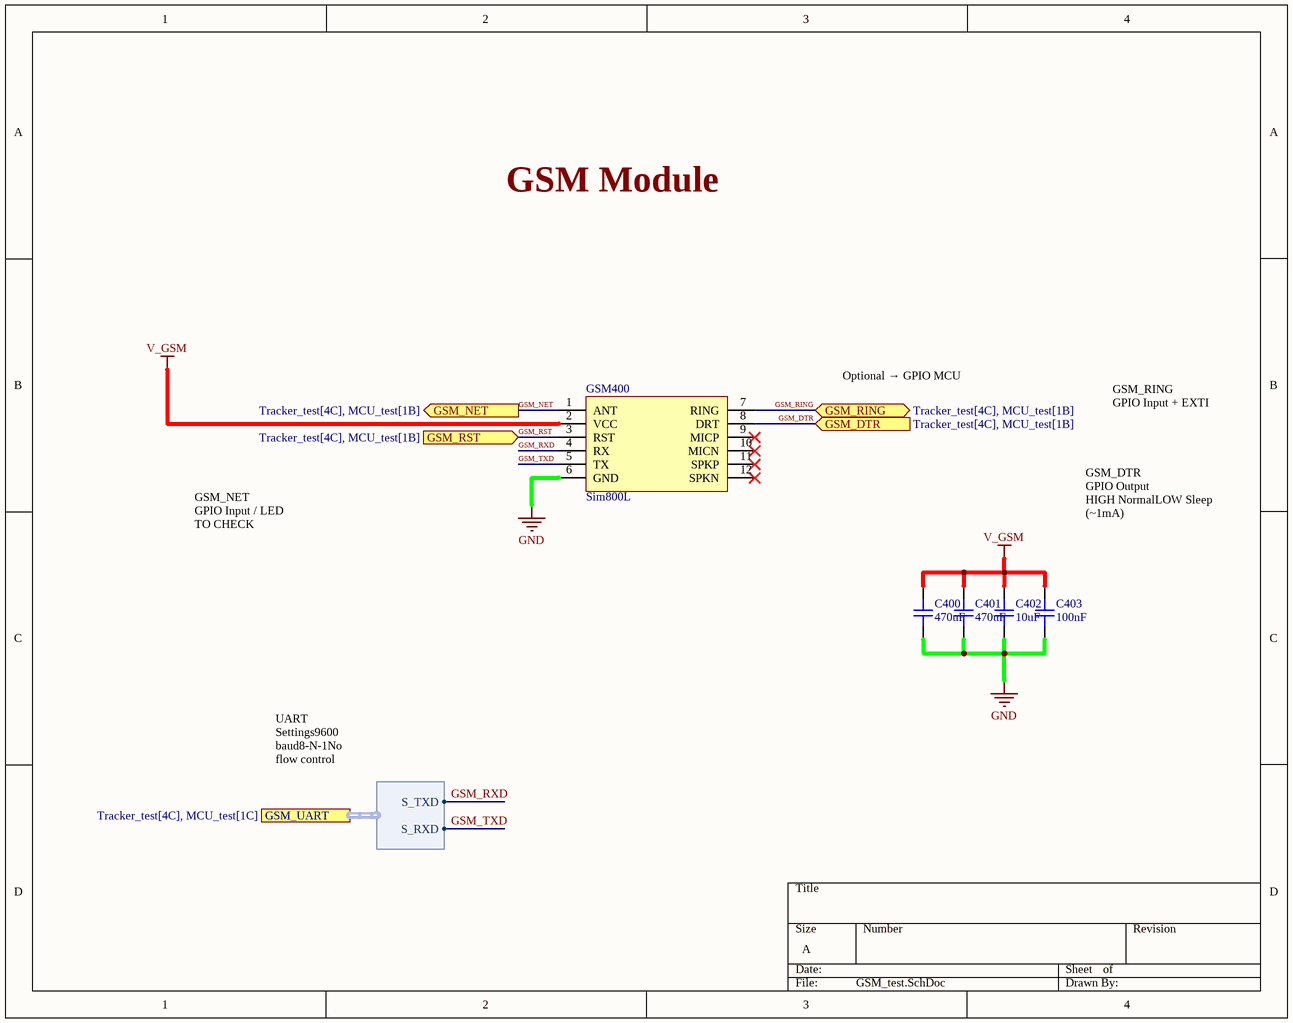
[diagram p4: GSM_test.SchDoc]

### Parts
C400  470uF  [CAP_1206]
C401  470uF  [CAP_1206]
C402  10uF  [CAP_1206]
C403  100nF  [CAP_0603]
GSM400  Sim800L  [Sim800L]

### Ports
GSM_DTR (in, see Tracker_test[4C], MCU_test[1B]), GSM_NET (out, see Tracker_test[4C], MCU_test[1B]), GSM_RING (bidir, see Tracker_test[4C], MCU_test[1B]), GSM_RST (in, see Tracker_test[4C], MCU_test[1B]), GSM_UART (harness GSM_UART, see Tracker_test[4C], MCU_test[1C])

### Harnesses
GSM_UART: S_TXD, S_RXD

### Nets
GND: C400.1 C401.1 C402.1 C403.1 GSM400.6(GND)
V_GSM: C400.2 C401.2 C402.2 C403.2 GSM400.2(VCC)
GSM_DTR: GSM400.8(DRT) ; port GSM_DTR  [project net DTR]
GSM_NET: GSM400.1(ANT) ; port GSM_NET
GSM_RING: GSM400.7(RING) ; port GSM_RING
GSM_RST: GSM400.3(RST) ; port GSM_RST
GSM_RXD: GSM400.4(RX) ; port GSM_UART.S_TXD
GSM_TXD: GSM400.5(TX) ; port GSM_UART.S_RXD

Not connected (* = marked no-connect by the designer): GSM400 9(MICP)* 10(MICN)* 11(SPKP)* 12(SPKN)*

### Notes on the sheet
- GSM Module
- Optional → GPIO MCU
- GSM_RING
  GPIO Input + EXTI
- GSM_NET
  GPIO Input / LED
  TO CHECK
- GSM_DTR
  GPIO Output
  HIGH	NormalLOW	Sleep (~1mA)
- UART Settings9600 baud8-N-1No flow control

### Library data of the parts
C400-C402 = CAP_1206: Capacitor SMD 1206; Manufacturer: *; Manufacturer Part Number: *; Distributor Link: *; LCSC: *; Rating: *; Dielectric: *
C403 = CAP_0603: Capacitor SMD 0603; Manufacturer: *; Manufacturer Part Number: *; Distributor Link: *; LCSC: *; Rating: *; Dielectric: *

## Nets that join several sheets
GND: GPS_test (18 pins), Power_test (45 pins), MCU_test (17 pins), GSM_test (5 pins)
V_GSM: Power_test (8 pins), GSM_test (5 pins)
VDD: GPS_test (C300.1 C301.2 R300.2), Power_test (8 pins), MCU_test (14 pins)
VGPS: GPS_test (C302.1 C303.2 U300.9), Power_test (+3.2V.1 U200.6)
DTR: MCU_test (R503.1 U500.27), GSM_test (GSM400.8)
GPS_FIX: GPS_test (U300.2), MCU_test (U500.10)
GPS_FON: GPS_test (U300.28), MCU_test (U500.6)
GPS_GEO: GPS_test (U300.24), MCU_test (U500.18)
GPS_INT: GPS_test (U300.7), MCU_test (U500.11)
GPS_JAM: GPS_test (U300.20), MCU_test (U500.12)
GPS_PPS: GPS_test (U300.29), MCU_test (U500.7)
GPS_RST: GPS_test (U300.23), MCU_test (U500.13)
GPS_RXD: GPS_test (R303.1), MCU_test (U500.19)
GPS_TXD: GPS_test (R301.1), MCU_test (U500.20)
GSM_NET: MCU_test (R502.2 U500.14), GSM_test (GSM400.1)
GSM_RING: MCU_test (R504.2 U500.26), GSM_test (GSM400.7)
GSM_RST: MCU_test (R5.2 U500.15), GSM_test (GSM400.3)
GSM_RXD: MCU_test (U500.8), GSM_test (GSM400.4)
GSM_TXD: MCU_test (U500.9), GSM_test (GSM400.5)
LS_GPS: Power_test (U200.4), MCU_test (U500.29)
USB_D_N: Power_test (J202.A7 J202.B7), MCU_test (U500.21)
USB_D_P: Power_test (J202.A6 J202.B6), MCU_test (U500.22)